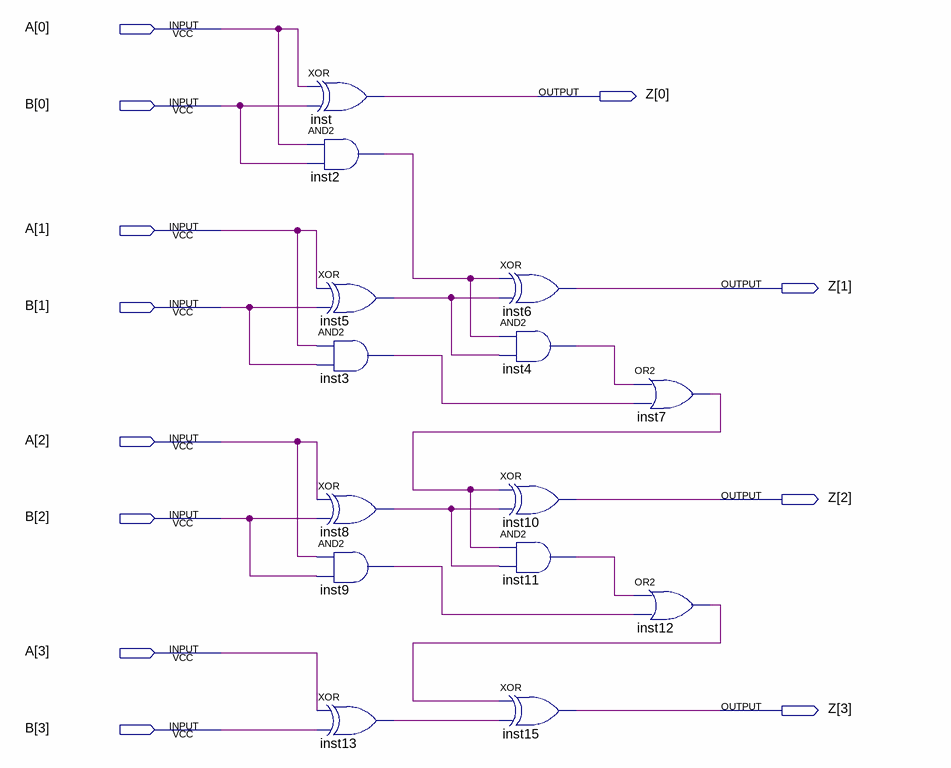
[diagram p0: schematic sheet]
// Quartus schematic ALU.bdf as structural Verilog: 14 symbols, 12 pins
module ALU (
  input  [3:0] A,
  input  [3:0] B,
  output [3:0] Z
);

  wire inst2_out, inst3_out, inst4_out, inst5_out, inst7_out, inst8_out, inst9_out, inst11_out, inst12_out,
       inst13_out;

  xor inst (Z[0], A[0], B[0]);
  and inst2 (inst2_out, A[0], B[0]);
  xor inst5 (inst5_out, A[1], B[1]);
  and inst3 (inst3_out, A[1], B[1]);
  xor inst8 (inst8_out, A[2], B[2]);
  and inst9 (inst9_out, A[2], B[2]);
  xor inst13 (inst13_out, A[3], B[3]);
  xor inst6 (Z[1], inst2_out, inst5_out);
  and inst4 (inst4_out, inst2_out, inst5_out);
  xor inst10 (Z[2], inst7_out, inst8_out);
  and inst11 (inst11_out, inst7_out, inst8_out);
  xor inst15 (Z[3], inst12_out, inst13_out);
  or inst7 (inst7_out, inst4_out, inst3_out);
  or inst12 (inst12_out, inst11_out, inst9_out);
endmodule
